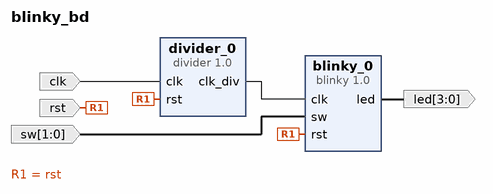
[diagram p0: block diagram of the top level]
# Vivado block design blinky_bd, xc7z020clg400-1, Vivado 2018.2
create_bd_design blinky_bd

create_bd_port -dir O -from 3 -to 0 -type data led
create_bd_port -dir I -from 1 -to 0 -type data sw
create_bd_port -dir I -type rst rst
set_property -dict {CONFIG.POLARITY ACTIVE_HIGH} [get_bd_ports rst]
create_bd_port -dir I -type clk clk

create_bd_cell -type ip -vlnv vlsilab:vlsilab:divider:1.0 divider_0
create_bd_cell -type ip -vlnv vlsilab:vlsilab:blinky:1.0 blinky_0

# ---- connections ----

connect_bd_net [get_bd_pins divider_0/clk_div] [get_bd_pins blinky_0/clk]
connect_bd_net [get_bd_ports clk] [get_bd_pins divider_0/clk]
connect_bd_net [get_bd_ports rst] [get_bd_pins divider_0/rst] [get_bd_pins blinky_0/rst]
connect_bd_net [get_bd_ports sw] [get_bd_pins blinky_0/sw]
connect_bd_net [get_bd_pins blinky_0/led] [get_bd_ports led]

validate_bd_design
save_bd_design
